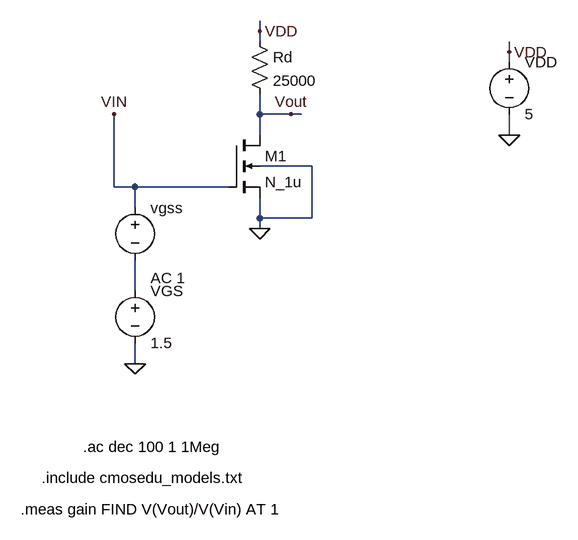
[diagram p0: schematic circuit.asc]
circuit.asc, the LTspice schematic file:
Version 4
SHEET 1 880 704
WIRE 224 -64 224 -80
WIRE 224 -48 224 -64
WIRE 608 -32 608 -48
WIRE 608 -16 608 -32
WIRE 224 64 224 32
WIRE 272 64 224 64
WIRE 288 64 272 64
WIRE 224 96 224 64
WIRE 608 96 608 64
WIRE 304 144 224 144
WIRE 0 176 0 64
WIRE 32 176 0 176
WIRE 176 176 32 176
WIRE 32 208 32 176
WIRE 224 224 224 192
WIRE 304 224 304 144
WIRE 304 224 224 224
WIRE 224 240 224 224
WIRE 32 336 32 288
WIRE 32 448 32 416
FLAG 224 -64 VDD
FLAG 608 96 0
FLAG 224 240 0
FLAG 32 448 0
FLAG 272 64 Vout
FLAG 608 -32 VDD
FLAG 0 64 VIN
SYMBOL nmos4 176 96 R0
SYMATTR InstName M1
SYMATTR Value N_1u
SYMATTR Value2 l=1.5u w=3u
SYMBOL res 208 -64 R0
SYMATTR InstName Rd
SYMATTR Value 25000
SYMBOL voltage 608 -32 R0
SYMATTR InstName VDD
SYMATTR Value 5
SYMBOL voltage 32 192 R0
WINDOW 123 24 124 Left 2
WINDOW 39 0 0 Left 2
SYMATTR Value2 AC 1
SYMATTR InstName vgss
SYMATTR Value ""
SYMBOL voltage 32 320 R0
SYMATTR InstName VGS
SYMATTR Value 1.5
TEXT -48 576 Left 2 !.ac dec 100 1 1Meg
TEXT -112 624 Left 2 !.include cmosedu_models.txt
TEXT -144 672 Left 2 !.meas gain FIND V(Vout)/V(Vin) AT 1

The netlist it stands for:
* circuit.asc
M1 Vout VIN 0 0 N_1u l=1.5u w=3u
Rd VDD Vout 25000
VDD VDD 0 5
vgss VIN N001 AC 1
VGS N001 0 1.5
.model NMOS NMOS
.model PMOS PMOS
.lib standard.mos
.ac dec 100 1 1Meg
.include cmosedu_models.txt
.meas gain FIND V(Vout)/V(Vin) AT 1
.backanno
.end